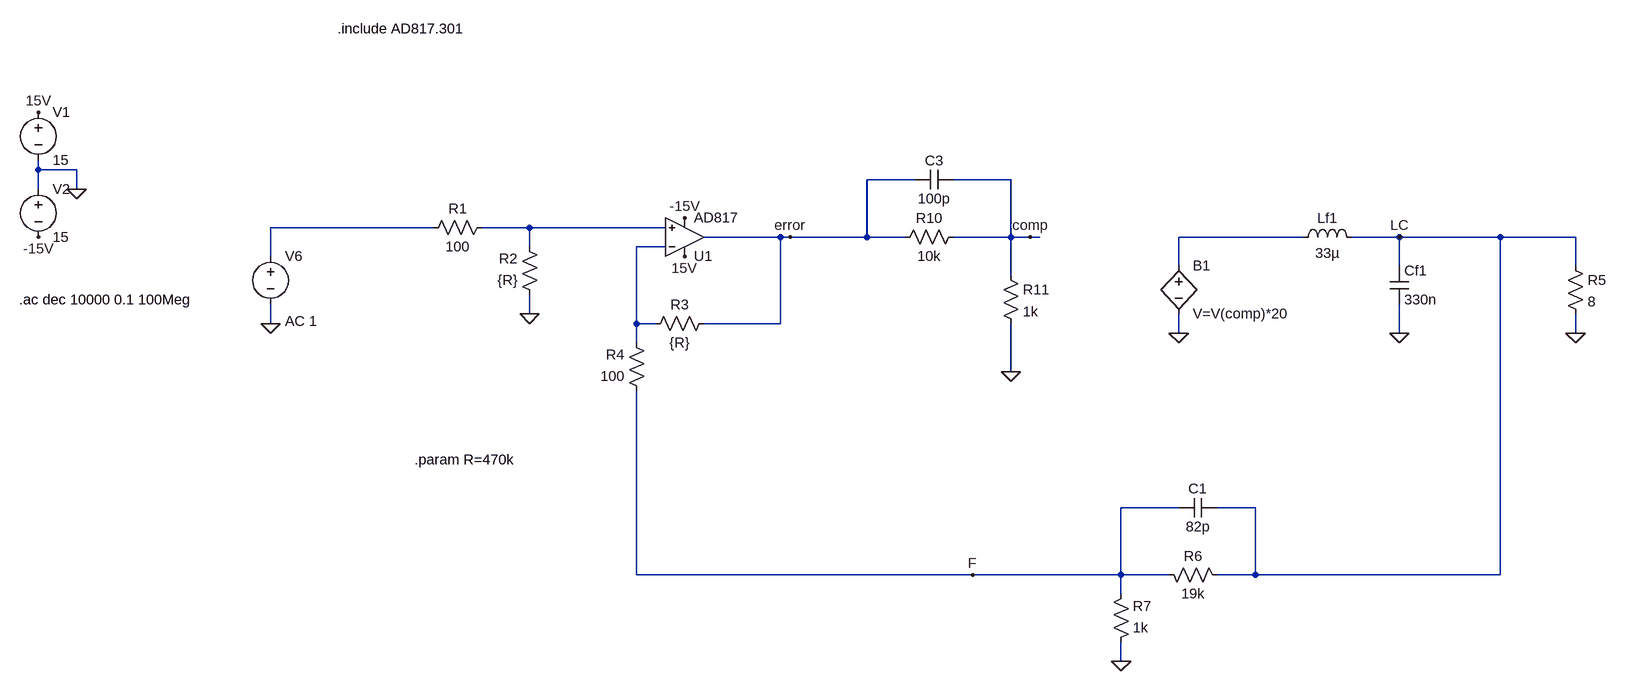
[diagram p0: schematic LazoCerrado.asc]
LazoCerrado.asc, the LTspice schematic file:
Version 4
SHEET 1 4728 996
WIRE -176 96 -176 80
WIRE -112 96 -176 96
WIRE 1792 112 1712 112
WIRE 1952 112 1856 112
WIRE -176 128 -176 96
WIRE -112 128 -112 96
WIRE 848 192 576 192
WIRE 1008 192 928 192
WIRE 1376 192 1008 192
WIRE 1568 208 1440 208
WIRE 1584 208 1568 208
WIRE 1712 208 1712 112
WIRE 1712 208 1584 208
WIRE 1776 208 1712 208
WIRE 1952 208 1952 112
WIRE 1952 208 1856 208
WIRE 1984 208 1952 208
WIRE 2000 208 1984 208
WIRE 2448 208 2240 208
WIRE 2608 208 2528 208
WIRE 2928 208 2608 208
WIRE 3440 208 2928 208
WIRE 1008 224 1008 192
WIRE 1376 224 1328 224
WIRE 576 240 576 192
WIRE 2240 256 2240 208
WIRE 2608 256 2608 208
WIRE 3440 256 3440 208
WIRE 1952 272 1952 208
WIRE 1008 336 1008 304
WIRE 576 352 576 320
WIRE 1328 352 1328 224
WIRE 1360 352 1328 352
WIRE 1568 352 1568 208
WIRE 1568 352 1440 352
WIRE 2240 368 2240 336
WIRE 2608 368 2608 320
WIRE 3440 368 3440 336
WIRE 1328 384 1328 352
WIRE 1952 432 1952 352
WIRE 2240 704 2144 704
WIRE 2368 704 2304 704
WIRE 1328 816 1328 464
WIRE 1888 816 1328 816
WIRE 2144 816 2144 704
WIRE 2144 816 1888 816
WIRE 2224 816 2144 816
WIRE 2368 816 2368 704
WIRE 2368 816 2304 816
WIRE 2928 816 2928 208
WIRE 2928 816 2368 816
WIRE 2144 848 2144 816
WIRE 2144 960 2144 928
FLAG -112 128 0
FLAG -176 208 -15V
FLAG -176 0 15V
FLAG 576 352 0
FLAG 1008 336 0
FLAG 1408 240 15V
FLAG 1408 176 -15V
FLAG 2608 368 0
FLAG 2608 208 LC
FLAG 1584 208 error
FLAG 3440 368 0
FLAG 2144 960 0
FLAG 1888 816 F
FLAG 2240 368 0
FLAG 1952 432 0
FLAG 1984 208 comp
SYMBOL voltage -176 -16 R0
WINDOW 123 0 0 Left 0
WINDOW 39 0 0 Left 0
SYMATTR InstName V1
SYMATTR Value 15
SYMBOL voltage -176 112 R0
WINDOW 123 0 0 Left 0
WINDOW 39 0 0 Left 0
SYMATTR InstName V2
SYMATTR Value 15
SYMBOL voltage 576 224 R0
WINDOW 123 24 124 Left 2
WINDOW 39 0 0 Left 0
SYMATTR Value2 AC 1
SYMATTR InstName V6
SYMATTR Value ""
SYMBOL Opamps\\opamp2 1408 272 M180
SYMATTR InstName U1
SYMATTR Value AD817
SYMBOL res 944 176 R90
WINDOW 0 0 56 VBottom 2
WINDOW 3 32 56 VTop 2
SYMATTR InstName R1
SYMATTR Value 100
SYMBOL res 1024 320 R180
WINDOW 0 36 76 Left 2
WINDOW 3 36 40 Left 2
SYMATTR InstName R2
SYMATTR Value {R}
SYMBOL res 1456 336 R90
WINDOW 0 0 56 VBottom 2
WINDOW 3 32 56 VTop 2
SYMATTR InstName R3
SYMATTR Value {R}
SYMBOL res 1344 480 R180
WINDOW 0 36 76 Left 2
WINDOW 3 36 40 Left 2
SYMATTR InstName R4
SYMATTR Value 100
SYMBOL ind 2432 224 R270
WINDOW 0 32 56 VTop 2
WINDOW 3 5 56 VBottom 2
SYMATTR InstName Lf1
SYMATTR Value 33µ
SYMBOL cap 2592 256 R0
SYMATTR InstName Cf1
SYMATTR Value 330n
SYMBOL res 3424 240 R0
SYMATTR InstName R5
SYMATTR Value 8
SYMBOL res 2208 800 M90
WINDOW 0 0 56 VBottom 2
WINDOW 3 32 56 VTop 2
SYMATTR InstName R6
SYMATTR Value 19k
SYMBOL res 2128 944 M180
WINDOW 0 36 76 Left 2
WINDOW 3 36 40 Left 2
SYMATTR InstName R7
SYMATTR Value 1k
SYMBOL bv 2240 240 R0
SYMATTR InstName B1
SYMATTR Value V=V(comp)*20
SYMBOL cap 2240 688 M90
WINDOW 0 0 32 VBottom 2
WINDOW 3 32 32 VTop 2
SYMATTR InstName C1
SYMATTR Value 82p
SYMBOL res 1872 192 R90
WINDOW 0 0 56 VBottom 2
WINDOW 3 32 56 VTop 2
SYMATTR InstName R10
SYMATTR Value 10k
SYMBOL cap 1856 96 R90
WINDOW 0 0 32 VBottom 2
WINDOW 3 32 32 VTop 2
SYMATTR InstName C3
SYMATTR Value 100p
SYMBOL res 1936 256 R0
SYMATTR InstName R11
SYMATTR Value 1k
TEXT -208 312 Left 2 !.ac dec 10000 0.1 100Meg
TEXT 688 -448 Left 2 !.include AD817.301
TEXT 816 624 Left 2 !.param R=470k

The netlist it stands for:
* LazoCerrado.asc
V1 15V 0 15
V2 0 -15V 15
V6 N001 0 AC 1
XU1 N002 N004 15V -15V error AD817  ; pins In+ In- V+ V- OUT
R1 N002 N001 100
R2 0 N002 {R}
R3 error N004 {R}
R4 F N004 100
Lf1 N003 LC 33µ
Cf1 LC 0 330n
R5 LC 0 8
R6 F LC 19k
R7 0 F 1k
B1 N003 0 V=V(comp)*20
C1 F LC 82p
R10 comp error 10k
C3 comp error 100p
R11 comp 0 1k
.ac dec 10000 0.1 100Meg
.include AD817.301
.param R=470k
.backanno
.end